# EAGLE design isp_attinyx4_dip_adapter (EAGLE 6.1)
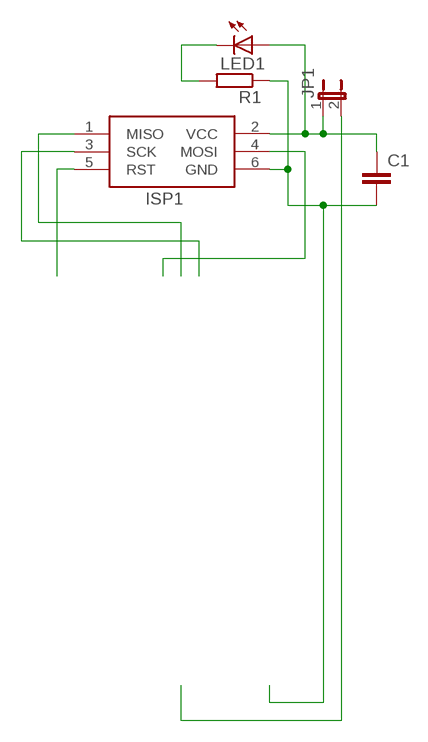
[diagram p0: schematic, sheet 1]

## Parts
C1  C-EUC0805K  [C0805K]
ISP1  AVRISP-6  [AVRISP]
JP1  JUMPER-2SMD-NO  [SJ_2S-NO]
LED1  LEDCHIPLED_0805  [CHIPLED_0805]
R1  R-EU_R0805  [R0805]

## Nets
N$1: ISP1.4(MOSI)
N$2: JP1.2
N$3: C1.2 ISP1.6(GND) R1.1
N$4: ISP1.5(RST)
N$5: ISP1.1(MISO)
N$6: ISP1.3(SCK)
N$12: LED1.C R1.2
VCC: C1.1 ISP1.2(VCC) JP1.1 LED1.A

## Library data of the parts
C1 = rcl:C-EU: CAPACITOR, European symbol
ISP1 = adafruit_t10:AVRISP: AVR ISP HEADER Standard 6 pin header for AVR programming
JP1 = SparkFun-Retired:JUMPER-2: Jumper Basic 0.1" spaced jumper. Use with breakaway headers.
LED1 = led:LED: LED OSRAM: - CHIPLED LG R971, LG N971, LY N971, LG Q971, LY Q971, LO R971, LY R971 LH N974, LH R974 LS Q976, LO Q976, LY Q976 LO Q996 - Hyper CHIPLED LW Q18S LB Q993, LB Q99A, LB R99A - SideLED LS A670, LO A670, LY A670, LG A670, LP A670 LB A673, LV A673, LT A673, LW A673 LH A674 LY A675 LS A676, LA A676, LO A676, LY A676, LW A676 LS A679, LY A679, LG A679 - Hyper Micro SIDELED® LS Y876, LA Y876, LO Y876, LY Y876 LT Y87S - SmartLED LW L88C, LW L88S LB L89C, LB L89S, LG L890 LS L89K, LO L89K, LY L89K LS L896, LA L896, LO L896, LY L896 - TOPLED LS T670, LO T670, LY T670, LG T670, LP T670 LSG T670, LSP T670, LSY T670, LOP T670, LYG T670 LG T671, LOG T671, LSG T671 LB T673, LV T673, LT T673, LW T673 LH T674 LS T676, LA T676, LO T676, LY T676, LB T676, LH T676, LSB T676, LW T676 LB T67C, LV T67C, LT T67C, LS T67K, LO T67K, LY T67K, LW E67C LS E67B, LA E67B, LO E67B, LY E67B, LB E67C, LV E67C, LT E67C LW T67C LS T679, LY T679, LG T679 LS T770, LO T770, LY T770, LG T770, LP T770 LB T773, LV T773, LT T773, LW T773 LH T774 LS E675, LA E675, LY E675, LS T675 LS T776, LA T776, LO T776, LY T776, LB T776 LHGB T686 LT T68C, LB T68C - Hyper Mini TOPLED® LB M676 - Mini TOPLED Santana® LG M470 LS M47K, LO M47K, LY M47K Source: http://www.osram.convergy.de LUXEON: - LUMILED® LXK2-PW12-R00, LXK2-PW12-S00, LXK2-PW14-U00, LXK2-PW14-V00 LXK2-PM12-R00, LXK2-PM12-S00, LXK2-PM14-U00 LXK2-PE12-Q00, LXK2-PE12-R00, LXK2-PE12-S00, LXK2-PE14-T00, LXK2-PE14-U00 LXK2-PB12-K00, LXK2-PB12-L00, LXK2-PB12-M00, LXK2-PB14-N00, LXK2-PB14-P00, LXK2-PB14-Q00 LXK2-PR12-L00, LXK2-PR12-M00, LXK2-PR14-Q00, LXK2-PR14-R00 LXK2-PD12-Q00, LXK2-PD12-R00, LXK2-PD12-S00 LXK2-PH12-R00, LXK2-PH12-S00 LXK2-PL12-P00, LXK2-PL12-Q00, LXK2-PL12-R00 Source: www.luxeon.com KINGBRIGHT: KA-3528ASYC Source: www.kingbright.com
R1 = rcl:R-EU_: RESISTOR, European symbol

## Board
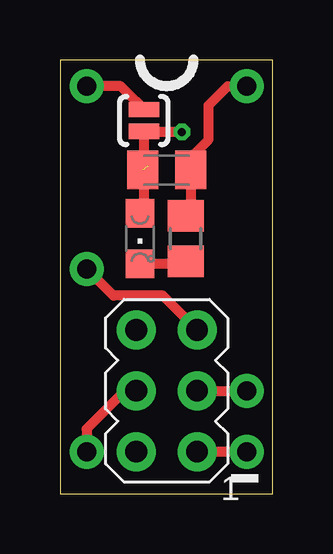
[diagram p1: board, top side]
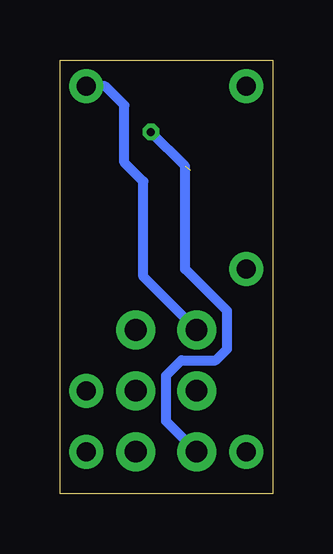
[diagram p2: board, bottom side, seen from below]

Size 8.87 x 18.09 mm. Coordinates in mm from the lower left corner, seen from the top.
Outline: 0,0 8.87,0 8.87,18.09 0,18.09 0,0
Copper layers (1*16): Top 0.0356mm / dielectric 1.5011mm / Bottom 0.0356mm
Design rules: minimum track width 6mil, minimum drill 13mil, track to track 6mil, track to pad 6mil, pad to pad 6mil, via to via 6mil, smd to smd 6mil, copper to edge 15mil, drill to drill 6mil, minimum pad ring 7mil, minimum via ring 7mil, stop-mask expansion 3mil, vias tented up to drill 0mil, thermal gap 10mil

### Footprints (pad centres in the part's own frame; a part is rotated, then mirrored left to right if it is on the bottom)
C0805K = smd 1.3 x 1.6: 1 -1,0; 2 1,0
AVRISP = drill 0.9 pad 1.626: 1 -1.27,2.54; 2 1.27,2.54; 3 -1.27,0; 4 1.27,0; 5 -1.27,-2.54; 6 1.27,-2.54
SJ_2S-NO = smd 0.635 x 1.27: 1 -0.45,0; 2 0.45,0
CHIPLED_0805 = smd 1.2 x 1.2: A 0,-1.05; C 0,1.05
R0805 = smd 1.3 x 1.5: 1 -0.95,0; 2 0.95,0

### Placement (x,y rotation side)
C1  4.45,13.49 0 top
ISP1  4.45,4.29 180 top
JP1  3.49,15.56 90 top
LED1  3.33,10.64 180 top
R1  5.24,10.64 270 top

### Tracks (layer width: path | path; a pad name or v marks a point on that pad's centre or on a via)
N$1
  Top 0.406: ISP1.4 2.7,4.29 1.11,2.7 1.11,1.75
N$2
  Top 0.406: JP1.2 3.2,16.32 2.54,16.99 1.11,16.99
N$3  (via drill 0.8 pad 1.42)
  Top 0.406: R1.1 5.45,11.63 C1.2 5.45,14.02 6.19,14.76 6.19,16.19 6.99,16.99 v7.78,16.99
  Bottom 0.406: ISP1.6 5.4,9.05 5.4,13.02 6.19,13.81 6.19,16.19 6.99,16.99 v7.78,16.99
N$4  (via drill 0.8 pad 1.42)
  Top 0.406: ISP1.5 4.29,8.26 2.22,8.26 v1.11,9.37
N$5  (via drill 0.8 pad 1.42)
  Top 0.406: v7.78,1.75 ISP1.1
N$6  (via drill 0.8 pad 1.42)
  Top 0.406: ISP1.3 v7.78,4.29
N$7  (via drill 0.8 pad 1.42)
  other vias: 1.11,16.99
N$8  (via drill 0.8 pad 1.42)
  other vias: 1.11,1.75
N$12
  Top 0.406: LED1.C 5.3,9.59 R1.2
VCC  (via drill 0.33)  (1 unrouted)
  Top 0.406: 3.47,11.71 LED1.A 3.49,11.85 3.49,14.92 3.52,15.11 3.52,15.08 | v5.08,15.08 3.52,15.08 | 3.52,15.08 JP1.1
  Bottom 0.406: ISP1.2 4.45,3.02 4.45,4.92 3.81,5.56 2.38,5.56 1.91,6.03 1.91,7.62 3.65,9.37 3.65,13.65 v5.08,15.08